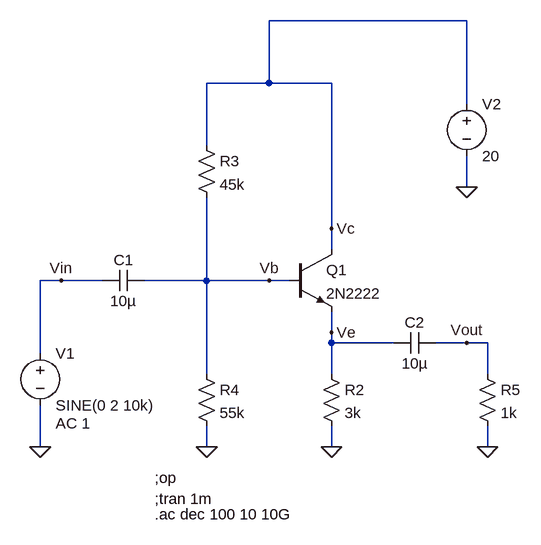
[diagram p0: schematic CC Amplifier.asc]
CC Amplifier.asc, the LTspice schematic file:
Version 4
SHEET 1 880 680
WIRE 448 -224 144 -224
WIRE 144 -128 144 -224
WIRE 144 -128 48 -128
WIRE 240 -128 144 -128
WIRE 448 -96 448 -224
WIRE 48 -32 48 -128
WIRE 448 32 448 -16
WIRE 240 96 240 -128
WIRE 240 128 240 96
WIRE -176 176 -208 176
WIRE -112 176 -176 176
WIRE 48 176 48 48
WIRE 48 176 -48 176
WIRE 144 176 48 176
WIRE 176 176 144 176
WIRE 240 256 240 224
WIRE 240 272 240 256
WIRE 336 272 240 272
WIRE 448 272 400 272
WIRE 480 272 448 272
WIRE -208 288 -208 176
WIRE 48 320 48 176
WIRE 240 320 240 272
WIRE 480 320 480 272
WIRE -208 432 -208 368
WIRE 48 432 48 400
WIRE 240 432 240 400
WIRE 480 432 480 400
FLAG 48 432 0
FLAG 240 432 0
FLAG -208 432 0
FLAG 480 432 0
FLAG 448 32 0
FLAG 240 96 Vc
FLAG 144 176 Vb
FLAG 240 256 Ve
FLAG 448 272 Vout
FLAG -176 176 Vin
SYMBOL npn 176 128 R0
SYMATTR InstName Q1
SYMATTR Value 2N2222
SYMBOL res 224 304 R0
SYMATTR InstName R2
SYMATTR Value 3k
SYMBOL res 32 -48 R0
SYMATTR InstName R3
SYMATTR Value 45k
SYMBOL res 32 304 R0
SYMATTR InstName R4
SYMATTR Value 55k
SYMBOL cap -48 160 R90
WINDOW 0 0 32 VBottom 2
WINDOW 3 32 32 VTop 2
SYMATTR InstName C1
SYMATTR Value 10µ
SYMBOL cap 400 256 R90
WINDOW 0 0 32 VBottom 2
WINDOW 3 32 32 VTop 2
SYMATTR InstName C2
SYMATTR Value 10µ
SYMBOL voltage -208 272 R0
WINDOW 123 24 124 Left 2
WINDOW 39 0 0 Left 0
SYMATTR Value2 AC 1
SYMATTR InstName V1
SYMATTR Value SINE(0 2 10k)
SYMBOL res 464 304 R0
SYMATTR InstName R5
SYMATTR Value 1k
SYMBOL voltage 448 -112 R0
WINDOW 123 0 0 Left 0
WINDOW 39 0 0 Left 0
SYMATTR InstName V2
SYMATTR Value 20
TEXT -32 480 Left 2 !;op
TEXT -32 512 Left 2 !;tran 1m
TEXT -32 536 Left 2 !.ac dec 100 10 10G

The netlist it stands for:
* CC Amplifier.asc
Q1 Vc Vb Ve 0 2N2222
R2 Ve 0 3k
R3 Vc Vb 45k
R4 Vb 0 55k
C1 Vb Vin 10µ
C2 Vout Ve 10µ
V1 Vin 0 SINE(0 2 10k) AC 1
R5 Vout 0 1k
V2 Vc 0 20
.model NPN NPN
.model PNP PNP
.lib standard.bjt
;op
;tran 1m
.ac dec 100 10 10G
.backanno
.end

* Results of the author's LTspice run, read from the files saved beside the schematic
* Operating Point, zero values left out:
*   V(vc) = 20 V
*   V(vb) = 10.62 V
*   V(ve) = 9.938 V
*   Ic(Q1) = 3.298 mA
*   Ib(Q1) = 15.23 µA
*   Ie(Q1) = -3.313 mA
*   I(R4) = 193.1 µA
*   I(R3) = 208.4 µA
*   I(R2) = 3.313 mA
*   I(V2) = -3.506 mA
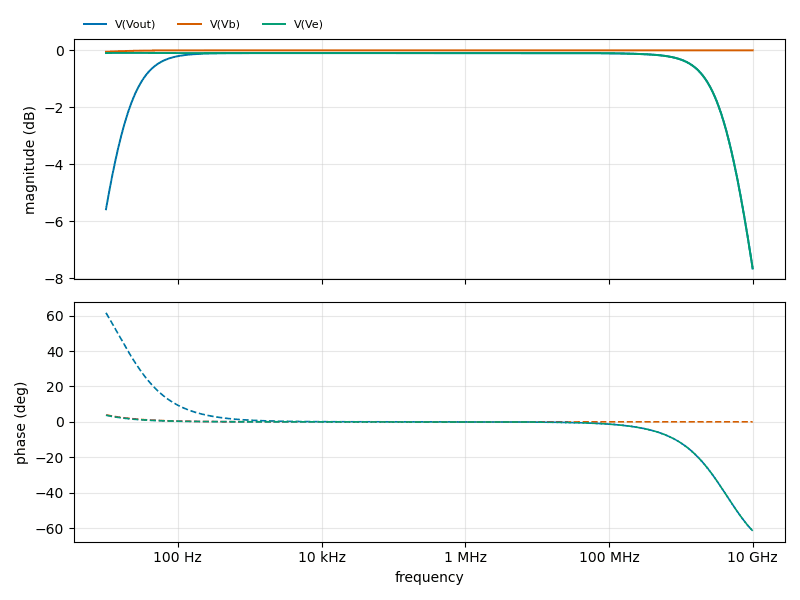
[diagram p1: AC Analysis of CC Amplifier.asc, plotted from the saved traces]
* AC Analysis, 1 run:
*   V(Vout): -5.58 dB at 10 Hz, -7.65 dB at 10 GHz, peak -0.10 dB at 190.5 kHz, 3 dB below the peak at 15.89 Hz and 4.594 GHz
*   V(Vb): -0.05 dB at 10 Hz, -0.00 dB at 10 GHz, peak -0.00 dB at 10 GHz
*   V(Ve): -0.09 dB at 10 Hz, -7.65 dB at 10 GHz, peak -0.09 dB at 16.6 Hz, 3 dB below the peak at 4.587 GHz